# Altium schematic sheet PWR1.SchDoc: Power1
size A; Revision: 04
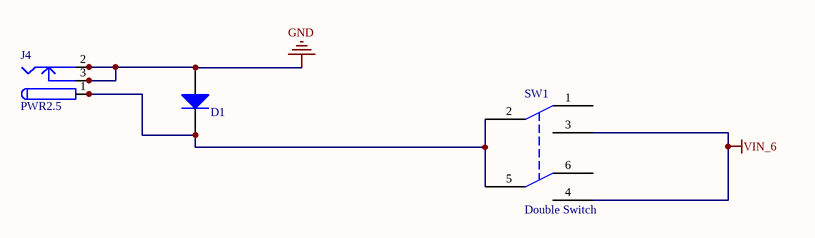
[diagram p0: PWR1.SchDoc]

## Parts
D1  SMD 4007 DIODE  [PCBComponent_1]  (value not drawn)
J4  PWR2.5  [KLD-0202]
SW1  Double Switch  [Switch - DPDT]

## Nets
GND: D1.1(A) J4.2 J4.2A J4.2B J4.3 J4.3A J4.3B
VIN_6: SW1.3 SW1.4
NetD1_2: D1.2(K) J4.1 J4.1A J4.1B SW1.2 SW1.5

Not connected (* = marked no-connect by the designer): SW1 1 6

## Notes on the sheet
- Engineer:
- Title:
- Saleh Jamali
- Revision:

## Library data of the parts
J4 = PWR2.5: Low Voltage Power Supply Connector; Published: 17-Dec-2003; DatasheetDocument: 09-May-2002; Publisher: Altium Limited; ComponentLink1Description: Manufacturer Link; ComponentLink1URL: http://domino.kycon.com/internet/Products.html
SW1 = Switch - DPDT: DPDT Switch